# EAGLE design Grove - Temperature&Humidity Sensor (High-Accuracy & Mini) V1.0 (EAGLE 6.4)

## Sheet 1 of 2
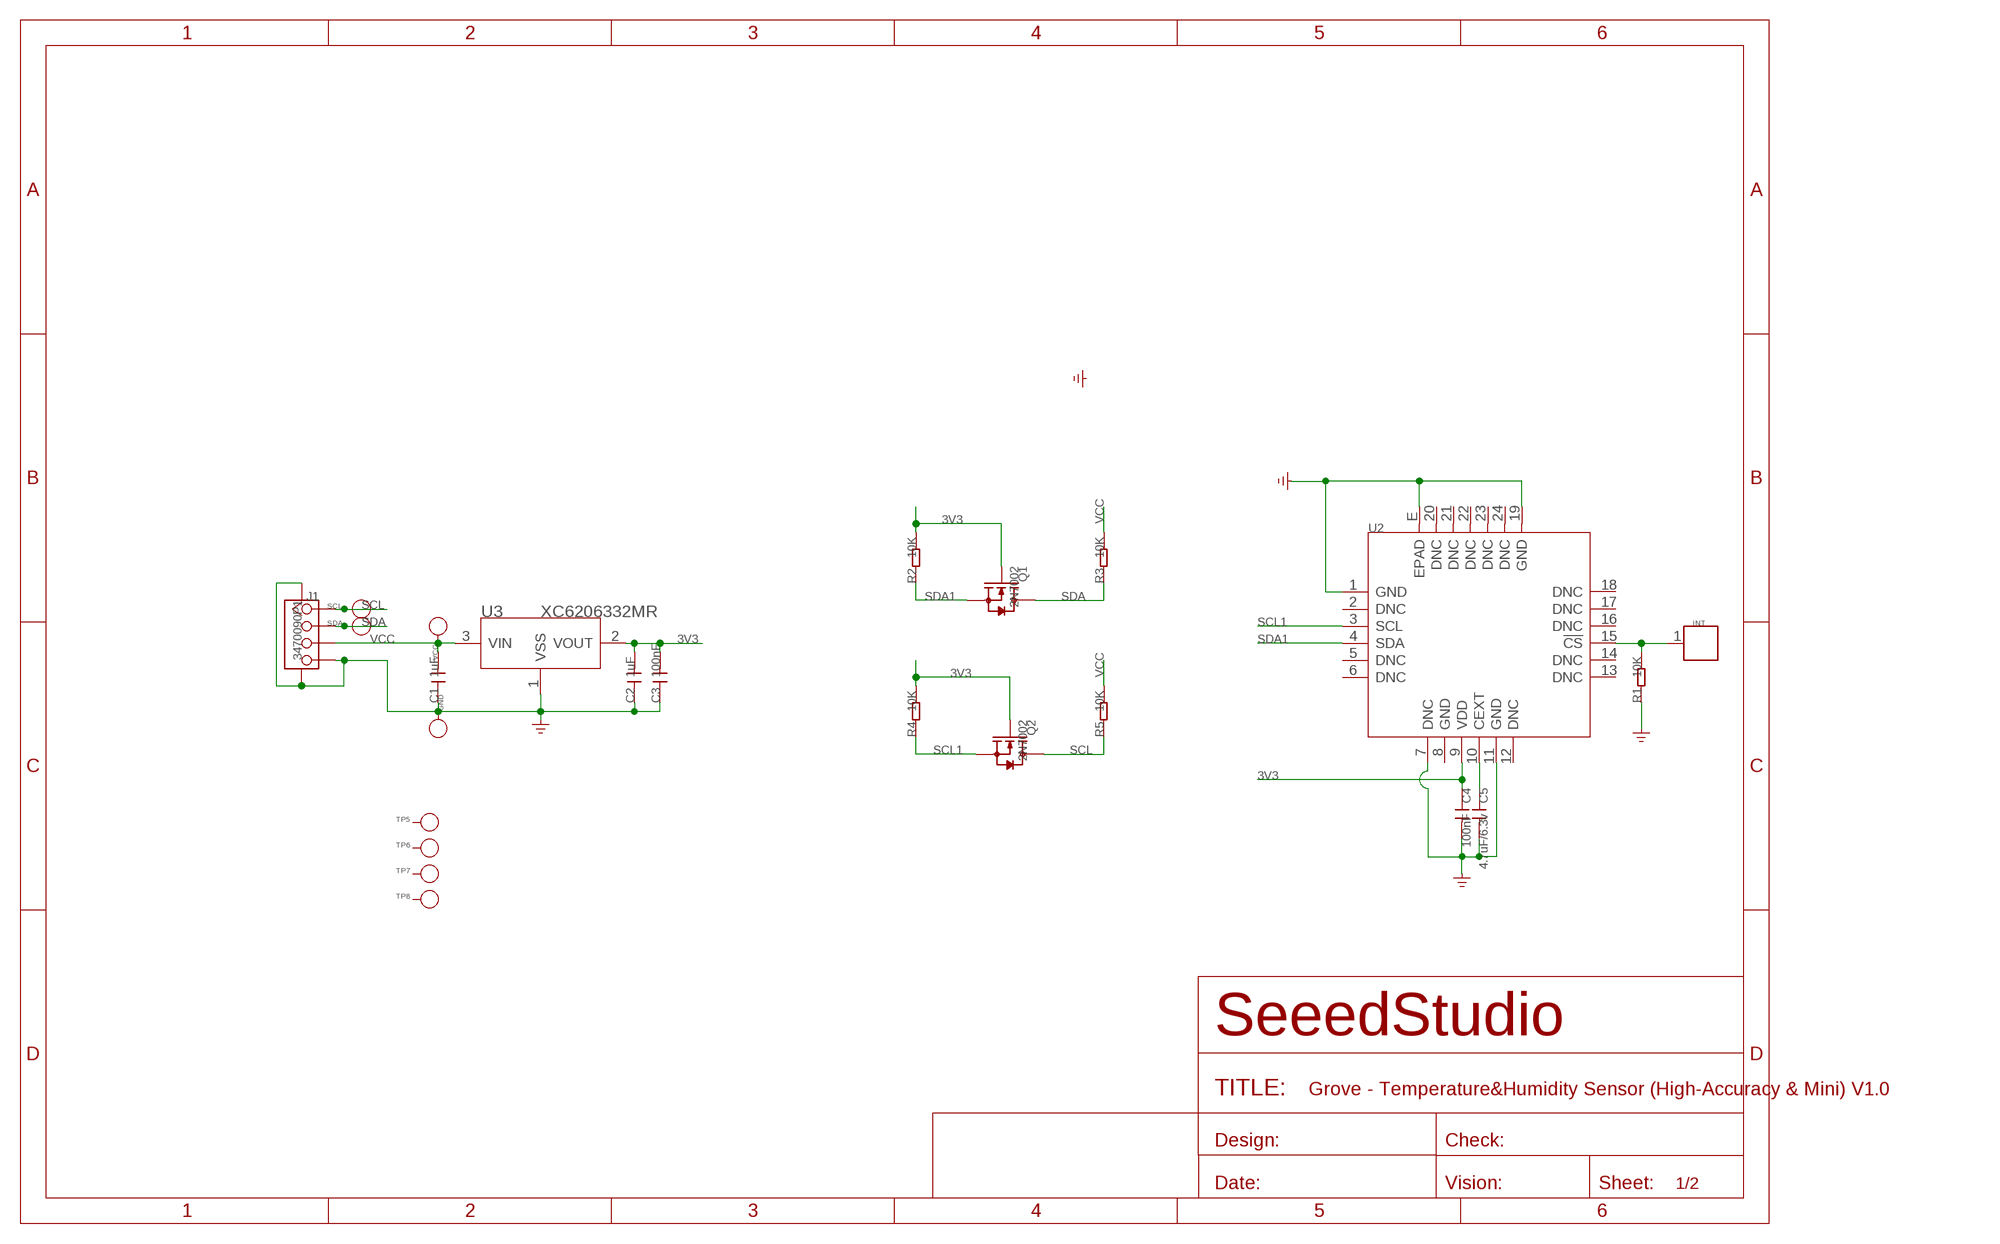
[diagram p0: schematic, sheet 1]

### Parts
C1  1uF  C-0603  [C0603]
C2  1uF  C-0603  [C0603]
C3  100nF  C-0603  [C0603]
C4  100nF  C-0603  [C0603]
C5  4.7uF/6.3v  C-0603  [C0603]
GND  PAD-TEST-POINT'4545'  [TP_4545]
INT  PAD'60/30'  [1P-65/35MIL]
J1  3470090P1  TWIG-4P-2.0-SMD-FEMALE-REINFORCE'DD'  [4P-SMD-2.0]
Q1  2N7002  MOSFET-N'SOT23'  [SOT23]
Q2  2N7002  MOSFET-N'SOT23'  [SOT23]
R1  10K  R-0603  [R0603]
R2  10K  R-0603  [R0603]
R3  10K  R-0603  [R0603]
R4  10K  R-0603  [R0603]
R5  10K  R-0603  [R0603]
SCL  PAD-TEST-POINT'4545'  [TP_4545]
SDA  PAD-TEST-POINT'4545'  [TP_4545]
TP5  PAD-TEST-POINT'4545'  [TP_4545]
TP6  PAD-TEST-POINT'4545'  [TP_4545]
TP7  PAD-TEST-POINT'4545'  [TP_4545]
TP8  PAD-TEST-POINT'4545'  [TP_4545]
U2  SENSOR-TH02  [QFN24]
U3  XC6206332MR  XC6206MR  [SOT23]
VCC  PAD-TEST-POINT'4545'  [TP_4545]

### Nets
3V3: C2.2 C3.2 C4.1 Q1.1(G) Q2.1(G) R2.2 R4.2 U2.9(VDD) U3.2(VOUT)
GND: C1.1 C2.1 C3.1 C4.2 C5.2 GND.T J1.4 J1.SS1 J1.SS2 R1.1 U2.1(GND) U2.7(DNC) U2.11(GND) U2.19(GND) U2.E(EPAD) U3.1(VSS)
N$4: C5.1 U2.10(CEXT)
N$7: INT.1 R1.2 U2.15(!CS)
SCL: J1.1 Q2.3(D) R5.1 SCL.T
SCL1: Q2.2(S) R4.1 U2.3(SCL)
SDA: J1.2 Q1.3(D) R3.1 SDA.T
SDA1: Q1.2(S) R2.1 U2.4(SDA)
VCC: C1.2 J1.3 R3.2 R5.2 U3.3(VIN) VCC.T
Unconnected: TP5.T TP6.T TP7.T TP8.T U2.2(DNC) U2.5(DNC) U2.6(DNC) U2.8(GND) U2.12(DNC) U2.13(DNC) U2.14(DNC) U2.16(DNC) U2.17(DNC) U2.18(DNC) U2.20(DNC) U2.21(DNC) U2.22(DNC) U2.23(DNC) U2.24(DNC)

## Sheet 2 of 2
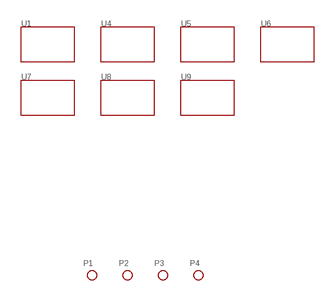
[diagram p1: schematic, sheet 2]

### Parts
P1  PAD-MARK  [ROUND-MARK-1.0]
P2  PAD-MARK  [ROUND-MARK-1.0]
P3  PAD-MARK  [ROUND-MARK-1.0]
P4  PAD-MARK  [ROUND-MARK-1.0]
U1  TWIG'2U'  [GROVE-TEST-PLATFORM]
U4  TWIG'2U'  [GROVE-TEST-PLATFORM]
U5  TWIG'2U'  [GROVE-TEST-PLATFORM]
U6  TWIG'2U'  [GROVE-TEST-PLATFORM]
U7  TWIG'2U'  [GROVE-TEST-PLATFORM]
U8  TWIG'2U'  [GROVE-TEST-PLATFORM]
U9  TWIG'2U'  [GROVE-TEST-PLATFORM]

## Library data of the parts
C1-C5 = Discrete:C*: Ceramic Capacitors
GND SCL SDA TP5-TP8 VCC = Discrete:PAD-TEST-POINT; PARTNO: DNP
INT = Discrete:PAD
J1 = Connector :TWIG-4P-2.0-SMD-FEMALE-REINFORCE
P1-P4 = Discrete:PAD-MARK; PARTNO: DNP
Q1 Q2 = Discrete:MOSFET-N: IRLL014: http://www.vishay.com/docs/91319/sihll014.pdf
R1-R5 = Discrete:R*
U1 U4-U9 = template:TWIG
U2 = template:SENSOR-TH02: Digital I2C Humidity and Temperature Sensor
U3 = IC:XC6206: LOW ESR Cap.Compatible Positive Voltage Regulators

## Board
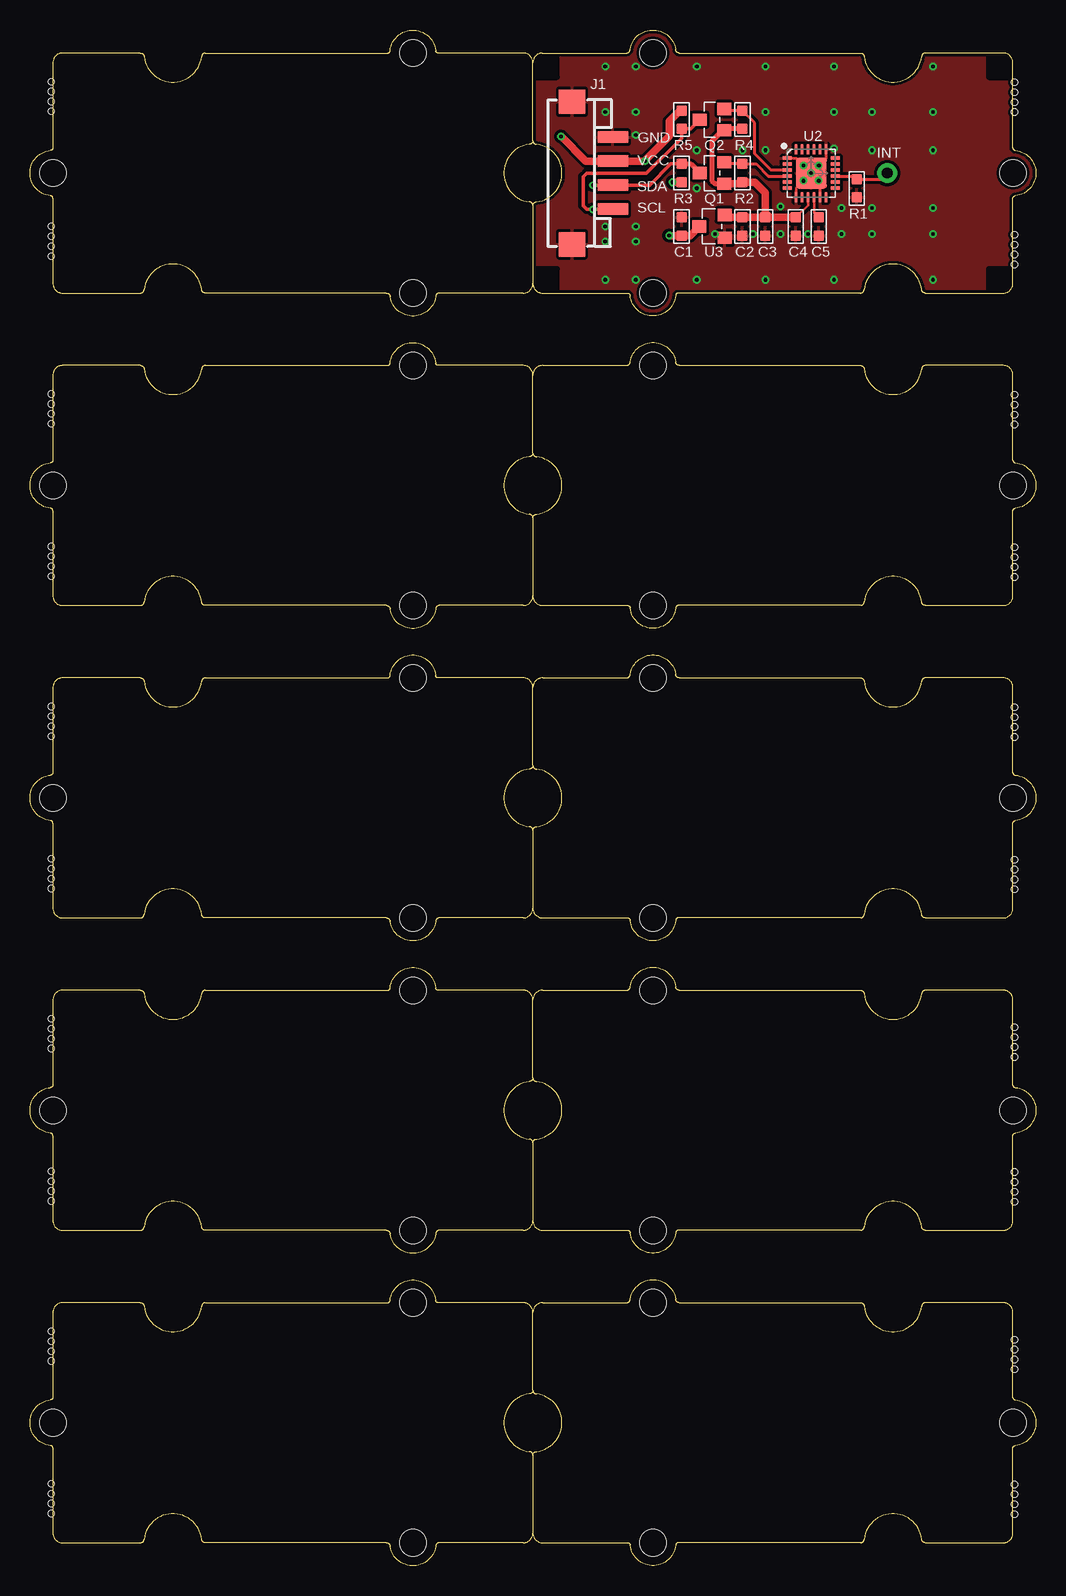
[diagram p2: board, top side]
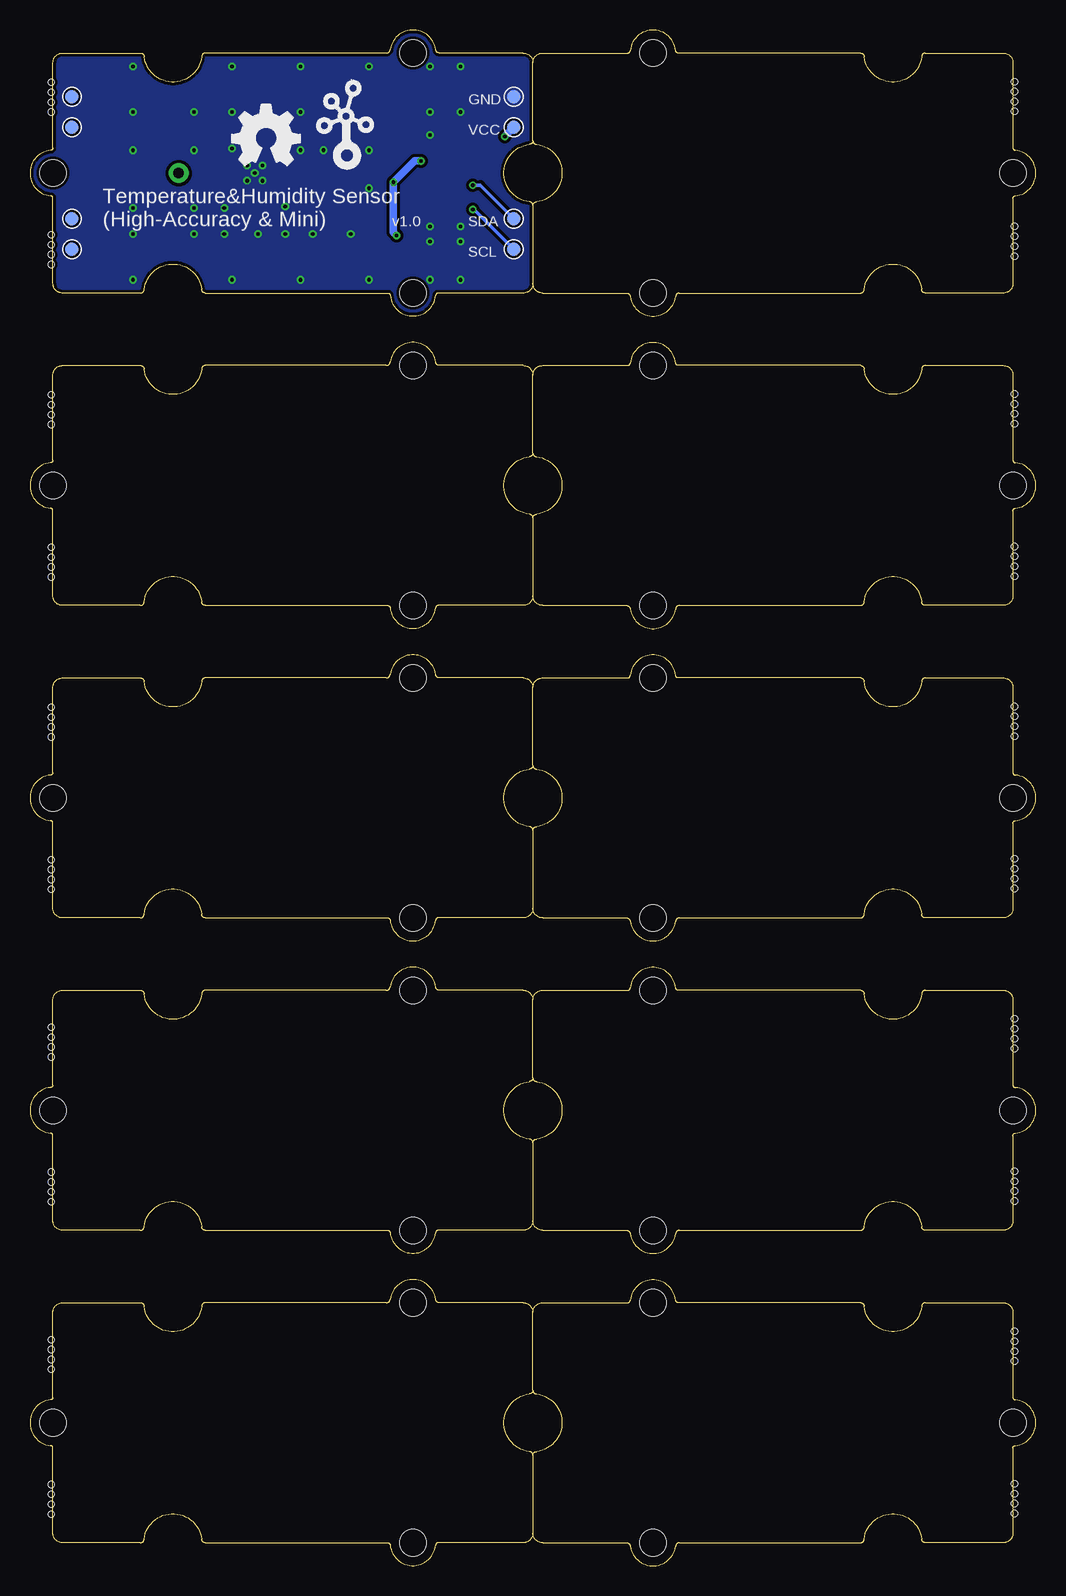
[diagram p3: board, bottom side, seen from below]

Size 83.82 x 127.98 mm. Coordinates in mm from the lower left corner, seen from the top.
Copper layers (1*16): Top 0.035mm / dielectric 1.5mm / Bottom 0.035mm
Design rules "SeeedStudio_2layer_DRU_no_angle_20140221 *": minimum track width 6mil, minimum drill 12mil, track to track 6mil, track to pad 6mil, pad to pad 6mil, via to via 6mil, smd to smd 0mil, copper to edge 10mil, drill to drill 10mil, minimum pad ring 10mil, minimum via ring 6mil, stop-mask expansion 2mil, vias tented up to drill 100mil, thermal gap 10mil
Holes 0.5 mm at 1.78,32.88 1.78,30.4 1.78,31.23 1.78,32.05 1.78,45.58 1.78,43.1 1.78,43.93 1.78,44.75 1.78,58.91 1.78,56.43 1.78,57.26 1.78,58.09 1.78,71.61 1.78,69.13 1.78,69.96 1.78,70.79 1.78,84.95 1.78,82.47 1.78,83.3 1.78,84.12 1.78,97.65 1.78,95.17 1.78,96 1.78,96.82 1.78,111.62 1.78,109.14 1.78,109.97 1.78,110.79 1.78,123.68 1.78,121.2 1.78,122.03 1.78,122.86 82.04,121.14 82.04,123.62 82.04,122.79 82.04,121.97 82.04,108.44 82.04,110.92 82.04,110.09 82.04,109.27 82.04,95.11 82.04,97.58 82.04,96.76 82.04,95.93 82.04,82.41 82.04,84.88 82.04,84.06 82.04,83.23 82.04,69.07 82.04,71.55 82.04,70.72 82.04,69.9 82.04,56.37 82.04,58.85 82.04,58.02 82.04,57.2 82.04,42.4 82.04,44.88 82.04,44.05 82.04,43.23 82.04,30.34 82.04,32.81 82.04,31.99 82.04,31.16 1.78,6.84 1.78,4.36 1.78,5.19 1.78,6.02 1.78,19.54 1.78,17.06 1.78,17.89 1.78,18.72 82.04,16.37 82.04,18.84 82.04,18.02 82.04,17.19 82.04,4.3 82.04,6.78 82.04,5.95 82.04,5.13
Holes 1.91 mm at -4.13,2.4 87.95,2.4 87.95,125.59 -4.13,125.59

### Footprints (pad centres in the part's own frame; a part is rotated, then mirrored left to right if it is on the bottom)
C0603 = smd 0.889 x 0.889: 1 -0.762,0; 2 0.762,0
TP_4545 = smd 1.143 x 1.143: T 0,0
1P-65/35MIL = drill 0.889 pad 1.651: 1 0,0
4P-SMD-2.0 = smd 0.965 x 2.54: 1 -3,0; 2 -1,0; 3 1,0; 4 3,0 | smd 2.032 x 2.184: SS1 -5.946,3.4; SS2 5.946,3.4
ROUND-MARK-1.0 = smd 1.016 x 1.016: P$1 0,0
SOT23 = smd 1.016 x 1.143: 1 -0.889,-1.016; 2 0.889,-1.016; 3 0,1.016
R0603 = smd 0.889 x 0.889: 1 -0.762,0; 2 0.762,0
GROVE-TEST-PLATFORM = hole 2.2: -10,-10; -10,10; 20,0
QFN24 = smd 0.8 x 0.26: 1 -2,1.25; 2 -2,0.75; 3 -2,0.25; 4 -2,-0.25; 5 -2,-0.75; 6 -2,-1.25; 13 2,-1.25; 14 2,-0.75; 15 2,-0.25; 16 2,0.25; 17 2,0.75; 18 2,1.25 | smd 0.26 x 0.8: 7 -1.25,-2; 8 -0.75,-2; 9 -0.25,-2; 10 0.25,-2; 11 0.75,-2; 12 1.25,-2; 19 1.25,2; 20 0.75,2; 21 0.25,2; 22 -0.25,2; 23 -0.75,2; 24 -1.25,2 | smd 2.6 x 2.6: E 0.02,-0.01
SOT23' = smd 1.016 x 1.2: 1 -0.95,-1.06; 2 0.95,-1.06; 3 0,1.06
GROVE-TEST-PLATFORM@1 = hole 2.2: -10,-10; -10,10; 20,0
GROVE-2CONNECTOR-SMD = hole 2.2: -10,-10; -10,10; 20,0

### Placement (x,y rotation side)
C1  54.29,111.61 270 top
C2  59.37,111.61 90 top
C3  61.28,111.61 90 top
C4  63.82,111.62 270 top
C5  65.72,111.62 270 top
GND  43.5,122.41 0 bottom
INT  71.44,116.06 0 top
J1  48.57,116.06 90 top
P1  -4.13,7.48 0 top  (outside the outline)
P2  87.95,7.48 0 top  (outside the outline)
P3  -4.13,120.51 0 top  (outside the outline)
P4  87.95,120.51 0 top  (outside the outline)
Q1  56.83,116.06 90 top
Q2  56.83,120.51 90 top
R1  68.9,114.79 90 top
R2  59.37,116.06 270 top
R3  54.29,116.06 270 top
R4  59.37,120.51 270 top
R5  54.29,120.51 90 top
SCL  43.5,109.71 0 bottom
SDA  43.5,112.25 90 bottom
TP5  80.33,122.41 0 bottom
TP6  80.33,119.87 0 bottom
TP7  80.33,112.25 0 bottom
TP8  80.33,109.71 0 bottom
U1  61.91,37.96 0 top
U2  65.09,116.06 0 top
U3  XC6206332MR  [SOT23']  56.83,111.61 90 top
U4  21.91,37.96 180 top
U5  61.91,63.99 0 top
U6  21.91,63.99 180 top
U7  61.91,90.03 0 top
U8  21.91,90.03 180 top
U9  21.91,116.06 180 top
U11  [GROVE-TEST-PLATFORM@1]  61.91,11.92 0 top
U12  [GROVE-TEST-PLATFORM@1]  21.91,11.92 180 top
U$5  [GROVE-2CONNECTOR-SMD]  61.91,116.06 0 top
U$6  [OSHW_FILLX200_NOTEXT]  66.99,116.7 0 bottom
U$7  [TWIGLOGO]  57.46,117.33 0 bottom
VCC  43.5,119.87 0 bottom

### Tracks (layer width: path | path; a pad name or v marks a point on that pad's centre or on a via)
3V3
  Top 0.203: U2.9 64.84,113.4 C4.1
  Top 0.406: R4.2 57.98,119.74 Q2.1 57.72,119.62 56.83,118.73 56.83,115.43 57.09,115.17 Q1.1
  Top 0.61: U3.2 58.08,112.37 C2.2 C3.2 | C3.2 61.4,112.37 61.41,112.38 | 61.41,112.38 C3.2 | Q1.1 59.25,115.17 R2.2 60.39,115.3 61.28,114.41 C3.2 | 61.41,112.38 C4.1
GND  (via drill 0.3 pad 0.64)
  Top 0.203: U2.1 63.84,117.31 v64.45,116.7 | U2.19 66.34,117.31 v65.72,116.7 | U2.7 63.84,114.81 v64.45,115.43
  Top 0.254: U2.11 65.84,115.32 U2.E
  other vias: 59.37,117.97 61.28,117.97 50.48,124.95 70.17,117.97 70.17,121.14 70.17,113.14 70.17,110.98 47.94,121.14 50.48,119.24 50.48,121.14 47.94,111.62 47.94,124.95 55.56,124.95 66.99,124.95 47.94,110.35 55.56,107.17 66.99,107.17 61.28,124.95 61.28,107.17 75.25,124.95 75.25,117.97 75.25,113.14 75.25,110.98 75.25,107.17 47.94,107.17 50.48,111.62 50.48,110.35 50.48,107.17 55.56,114.79 55.56,117.97 62.55,113.27 62.55,110.98 64.83,110.98 67.63,110.98 60.26,110.98 57.09,110.98 66.99,121.14 61.28,121.14 75.25,121.14 67.63,113.14 65.09,116.06 65.72,115.43 66.99,118.09
  pour Top (isolate 0.254): 41.59,128.13 84.13,128.13 84.13,104 41.59,104
  pour Bottom (isolate 0.254): 41.59,128.13 84.13,128.13 84.13,104 41.59,104
N$4
  Top 0.203: U2.10 65.34,112.76 C5.1
N$7
  Top 0.254: U2.15 68.64,115.81 R1.2 70.93,115.55 INT.1
SCL  (via drill 0.3)
  Top 0.305: R5.1 54.42,119.74 | 54.42,119.74 55.06,119.74 Q2.3 | J1.1 46.98,113.06 | 46.98,113.06 v46.93,113.01 | 46.98,113.06 46.38,113.06 46.09,113.35 46.09,115.76 46.4,116.06 51.37,116.06 54.29,118.98 54.29,119.62 54.42,119.74
  Bottom 0.305: v46.93,113.01 46.8,113.01 SCL.T
SCL1
  Top 0.254: U2.3 61.77,116.31 60.39,117.69 60.39,120.25 R4.1 57.98,121.27 Q2.2
SDA  (via drill 0.3)
  Top 0.305: v46.93,115.05 46.94,115.06 J1.2 51.64,115.06 53.4,116.82 R3.1
  Top 0.406: R3.1 55.06,116.82 Q1.3
  Bottom 0.305: v46.93,115.05 46.29,115.05 SDA.T
SDA1
  Top 0.254: Q1.2 57.98,116.82 R2.1 60.52,116.82 61.53,115.81 U2.4
VCC  (via drill 0.3, 0.3 pad 0.64)
  Top 0.61: v44.26,119.11 46.31,117.06 J1.3 51.23,117.06 v51.25,117.08 53.28,119.11 53.28,120.38 54.17,121.27 R5.2 | v53.28,110.85 C1.2 55.01,110.85 U3.3 | R3.2 v53.53,115.3
  Bottom 0.61: v44.26,119.11 VCC.T | v53.28,110.85 53.53,111.11 v53.53,115.3 51.75,117.08 v51.25,117.08

### Text on the board
tPlace: GND | VCC | SDA | SCL
bPlace: Temperature&Humidity Sensor / (High-Accuracy & Mini)
tNames: INT
bNames: v1.0